# Altium schematic sheet Main.SchDoc
size A3
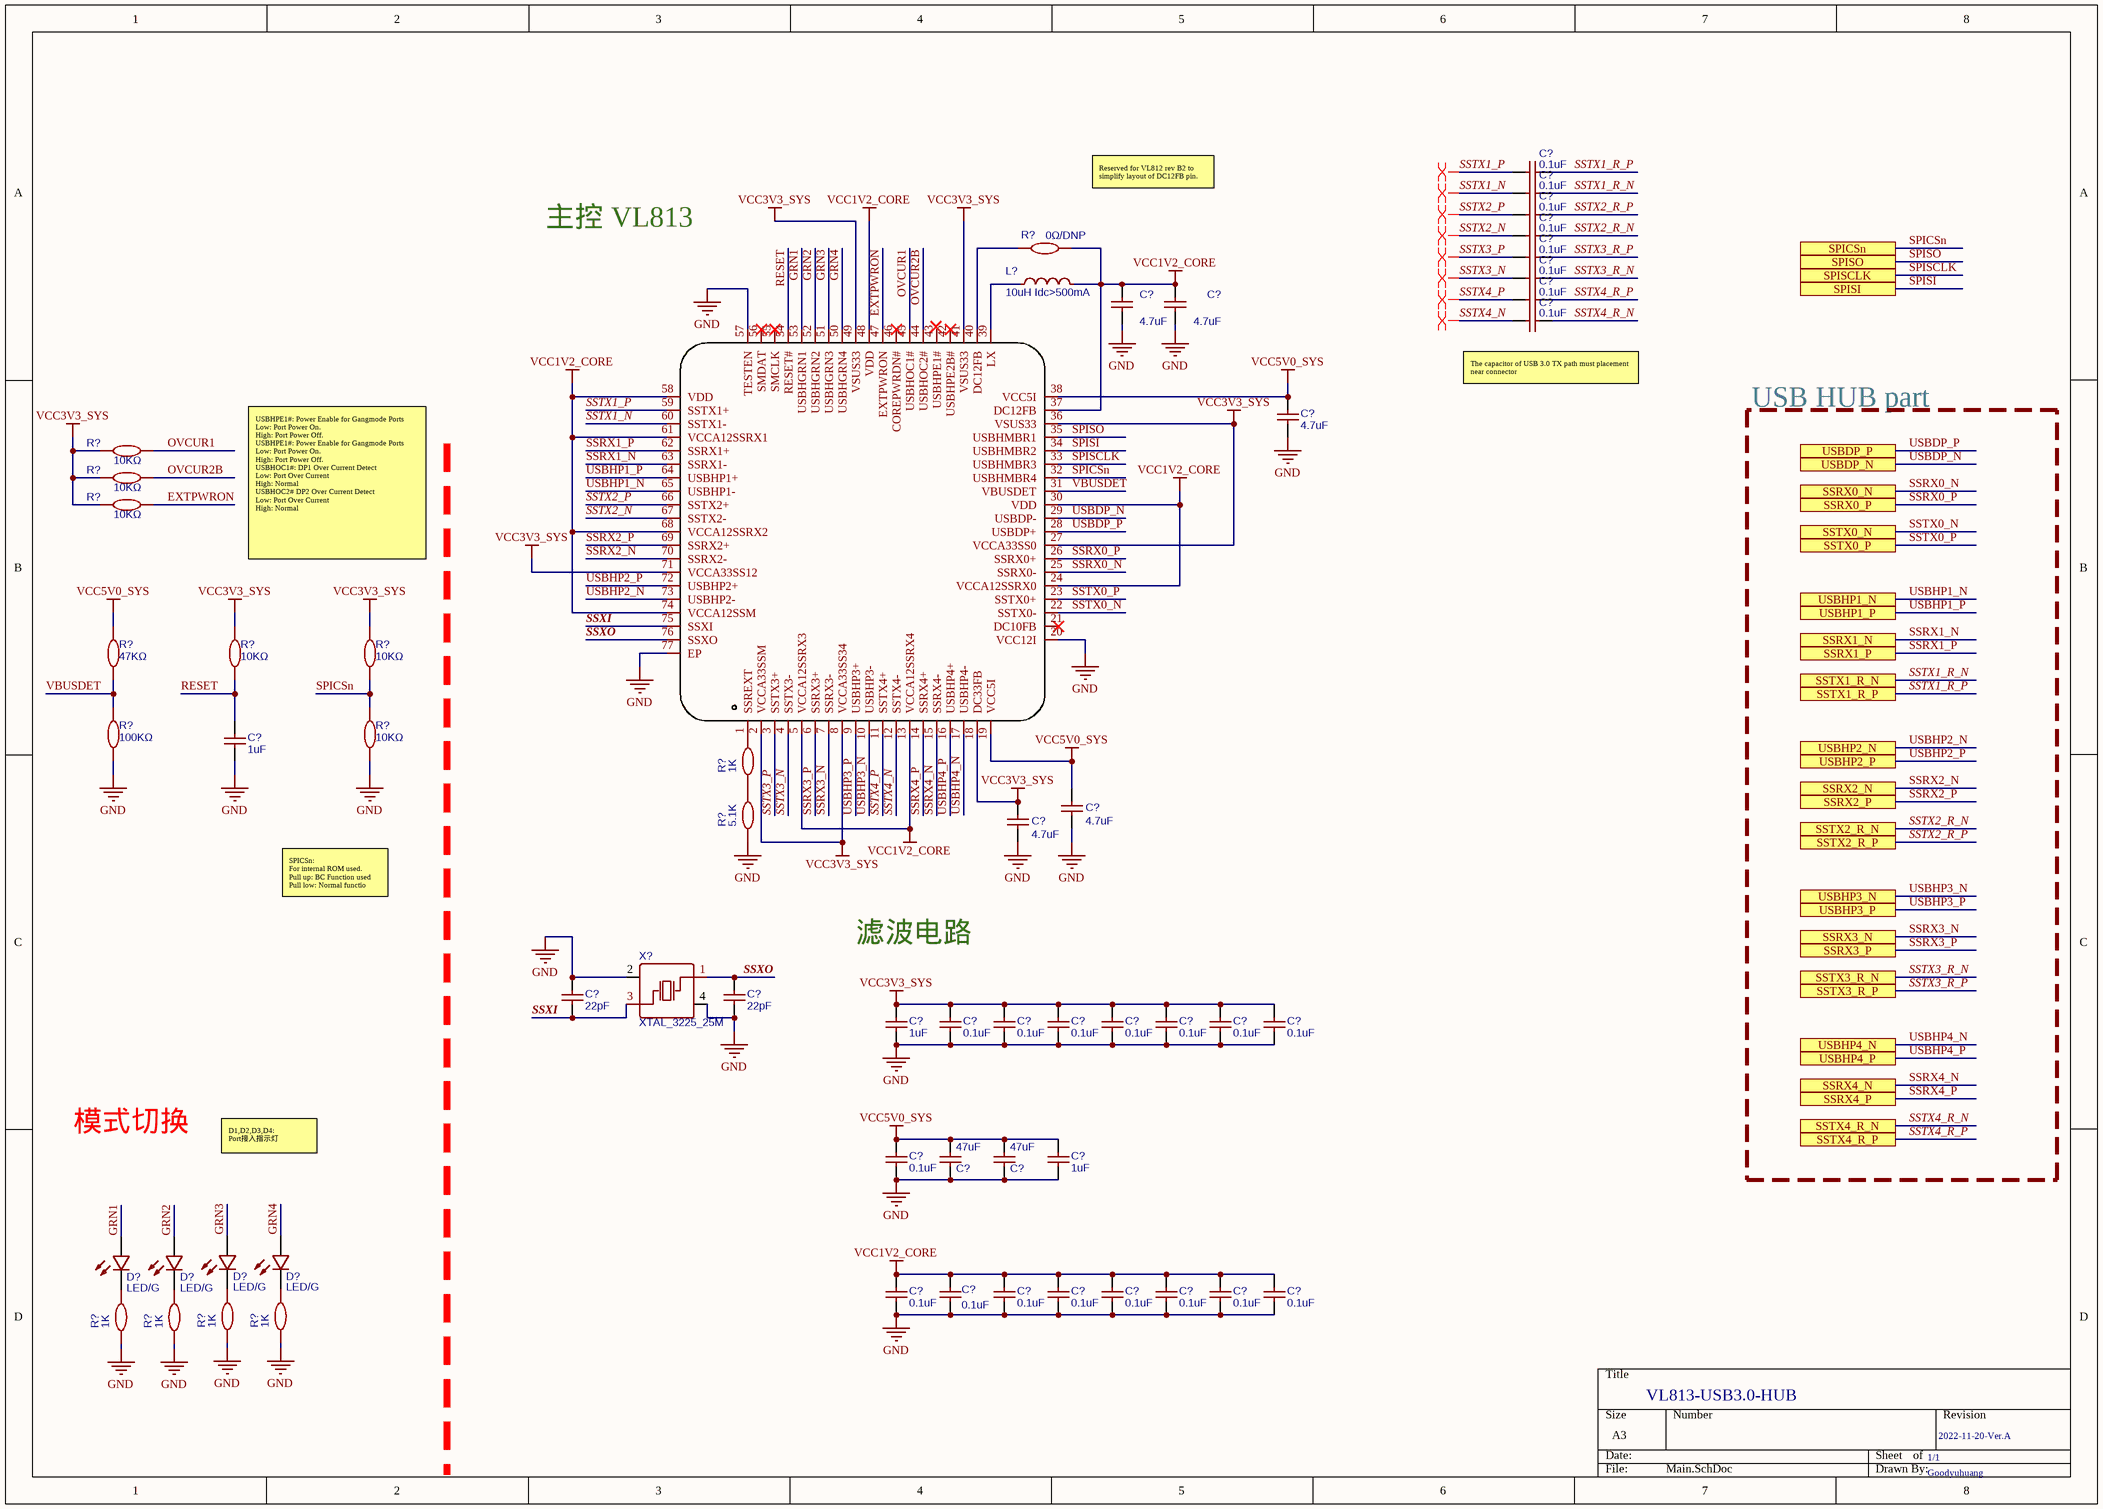
[diagram p0: Main.SchDoc]

## Parts
(Parts that share a designator on the sheet are numbered #1, #2 ... from top to bottom, then left to right.)
C?#1  0.1uF  [C0603]
C?#2  0.1uF  [C0603]
C?#3  0.1uF  [C0603]
C?#4  0.1uF  [C0603]
C?#5  0.1uF  [C0603]
C?#6  0.1uF  [C0603]
C?#7  4.7uF  [C0603]
C?#8  4.7uF  [C0603]
C?#9  0.1uF  [C0603]
C?#10  0.1uF  [C0603]
C?#11  4.7uF  [C0603]
C?#12  1uF  [C0603]
C?#13  4.7uF  [C0603]
C?#14  4.7uF  [C0603]
C?#15  22pF  [C0603]
C?#16  22pF  [C0603]
C?#17  1uF  [C0603]
C?#18  0.1uF  [C0603]
C?#19  0.1uF  [C0603]
C?#20  0.1uF  [C0603]
C?#21  0.1uF  [C0603]
C?#22  0.1uF  [C0603]
C?#23  0.1uF  [C0603]
C?#24  0.1uF  [C0603]
C?#25  0.1uF  [C0603]
C?#26  47uF  [C5*5]
C?#27  47uF  [C5*5]
C?#28  1uF  [C0603]
C?#29  0.1uF  [C0603]
C?#30  0.1uF  [C0603]
C?#31  0.1uF  [C0603]
C?#32  0.1uF  [C0603]
C?#33  0.1uF  [C0603]
C?#34  0.1uF  [C0603]
C?#35  0.1uF  [C0603]
C?#36  0.1uF  [C0603]
D?#1  LED/G  [LED0805-R-RD]
D?#2  LED/G  [LED0805-R-RD]
D?#3  LED/G  [LED0805-R-RD]
D?#4  LED/G  [LED0805-R-RD]
L?  10uH Idc>500mA  [Inductor]
R?#1  0Ω/DNP  [R0603]
R?#2  10KΩ  [R0603]
R?#3  10KΩ  [R0603]
R?#4  10KΩ  [R0603]
R?#5  47KΩ  [R0603]
R?#6  10KΩ  [R0603]
R?#7  10KΩ  [R0603]
R?#8  100KΩ  [R0603]
R?#9  10KΩ  [R0603]
R?#10  1K  [R0603]
R?#11  5.1K  [R0603]
R?#12  1K  [R0603]
R?#13  1K  [R0603]
R?#14  1K  [R0603]
R?#15  1K  [R0603]
U?  VL813(A1)  [QFN-76]  (value not drawn)
X?  XTAL_3225_25M  [OSC-SMD_4P-L3.2-W2.5-BL_SIT8008BI]

## Ports
SPICSn, SPISCLK, SPISI, SPISO, SSRX0_N, SSRX0_P, SSRX1_N, SSRX1_P, SSRX2_N, SSRX2_P, SSRX3_N, SSRX3_P, SSRX4_N, SSRX4_P, SSTX0_N, SSTX0_P, SSTX1_R_N, SSTX1_R_P, SSTX2_R_N, SSTX2_R_P, SSTX3_R_N, SSTX3_R_P, SSTX4_R_N, SSTX4_R_P, USBDP_N, USBDP_P, USBHP1_N, USBHP1_P, USBHP2_N, USBHP2_P, USBHP3_N, USBHP3_P, USBHP4_N, USBHP4_P

## Nets
GND: C?#7.2 C?#8.2 C?#11.2 C?#12.2 C?#13.2 C?#14.2 C?#15.2 C?#16.2 C?#17.2 C?#18.2 C?#19.2 C?#20.2 C?#21.2 C?#22.2 C?#23.2 C?#24.2 C?#25.2 C?#26.2 C?#27.2 C?#28.2 C?#29.2 C?#30.2 C?#31.2 C?#32.2 C?#33.2 C?#34.2 C?#35.2 C?#36.2 R?#8.2 R?#9.2 R?#11.2 R?#12.2 R?#13.2 R?#14.2 R?#15.2 U?.20(VCC12I) U?.57(TESTEN) U?.77(EP) X?.2(GND) X?.4(GND)
VCC1V2_CORE: C?#7.1 C?#8.1 C?#29.1 C?#30.1 C?#31.1 C?#32.1 C?#33.1 C?#34.1 C?#35.1 C?#36.1 L?.2 R?#1.1 U?.5(VCCA12SSRX3) U?.13(VCCA12SSRX4) U?.24(VCCA12SSRX0) U?.30(VDD) U?.37(DC12FB) U?.48(VDD) U?.58(VDD) U?.61(VCCA12SSRX1) U?.68(VCCA12SSRX2) U?.74(VCCA12SSM)
VCC3V3_SYS: C?#14.1 C?#17.1 C?#18.1 C?#19.1 C?#20.1 C?#21.1 C?#22.1 C?#23.1 C?#24.1 R?#2.1 R?#3.1 R?#4.1 R?#6.1 R?#7.1 U?.2(VCCA33SSM) U?.8(VCCA33SS34) U?.18(DC33FB) U?.27(VCCA33SS0) U?.36(VSUS33) U?.41(VSUS33) U?.49(VSUS33) U?.71(VCCA33SS12)
VCC5V0_SYS: C?#11.1 C?#13.1 C?#25.1 C?#26.1 C?#27.1 C?#28.1 R?#5.1 U?.19(VCC5I) U?.38(VCC5I)
EXTPWRON: R?#4.2 U?.47(EXTPWRON)
GRN1: D?#1.1(A) U?.53(USBHGRN1)
GRN2: D?#2.1(A) U?.52(USBHGRN2)
GRN3: D?#3.1(A) U?.51(USBHGRN3)
GRN4: D?#4.1(A) U?.50(USBHGRN4)
OVCUR1: R?#2.2 U?.45(USBHOC1#)
OVCUR2B: R?#3.2 U?.44(USBHOC2#)
RESET: C?#12.1 R?#6.2 U?.54(RESET#)
SPICSn: R?#7.2 R?#9.1 U?.32(USBHMBR4) ; port SPICSn
SPISCLK: U?.33(USBHMBR3) ; port SPISCLK
SPISI: U?.34(USBHMBR2) ; port SPISI
SPISO: U?.35(USBHMBR1) ; port SPISO
SSRX0_N: U?.25(SSRX0-) ; port SSRX0_N
SSRX0_P: U?.26(SSRX0+) ; port SSRX0_P
SSRX1_N: U?.63(SSRX1-) ; port SSRX1_N
SSRX1_P: U?.62(SSRX1+) ; port SSRX1_P
SSRX2_N: U?.70(SSRX2-) ; port SSRX2_N
SSRX2_P: U?.69(SSRX2+) ; port SSRX2_P
SSRX3_N: U?.7(SSRX3-) ; port SSRX3_N
SSRX3_P: U?.6(SSRX3+) ; port SSRX3_P
SSRX4_N: U?.15(SSRX4-) ; port SSRX4_N
SSRX4_P: U?.14(SSRX4+) ; port SSRX4_P
SSTX0_N: U?.22(SSTX0-) ; port SSTX0_N
SSTX0_P: U?.23(SSTX0+) ; port SSTX0_P
SSTX1_N: C?#2.1 U?.60(SSTX1-)
SSTX1_P: C?#1.1 U?.59(SSTX1+)
SSTX1_R_N: C?#2.2 ; port SSTX1_R_N
SSTX1_R_P: C?#1.2 ; port SSTX1_R_P
SSTX2_N: C?#4.1 U?.67(SSTX2-)
SSTX2_P: C?#3.1 U?.66(SSTX2+)
SSTX2_R_N: C?#4.2 ; port SSTX2_R_N
SSTX2_R_P: C?#3.2 ; port SSTX2_R_P
SSTX3_N: C?#6.1 U?.4(SSTX3-)
SSTX3_P: C?#5.1 U?.3(SSTX3+)
SSTX3_R_N: C?#6.2 ; port SSTX3_R_N
SSTX3_R_P: C?#5.2 ; port SSTX3_R_P
SSTX4_N: C?#10.1 U?.12(SSTX4-)
SSTX4_P: C?#9.1 U?.11(SSTX4+)
SSTX4_R_N: C?#10.2 ; port SSTX4_R_N
SSTX4_R_P: C?#9.2 ; port SSTX4_R_P
SSXI: C?#15.1 U?.75(SSXI) X?.3(OSC2)
SSXO: C?#16.1 U?.76(SSXO) X?.1(OSC1)
USBDP_N: U?.29(USBDP-) ; port USBDP_N
USBDP_P: U?.28(USBDP+) ; port USBDP_P
USBHP1_N: U?.65(USBHP1-) ; port USBHP1_N
USBHP1_P: U?.64(USBHP1+) ; port USBHP1_P
USBHP2_N: U?.73(USBHP2-) ; port USBHP2_N
USBHP2_P: U?.72(USBHP2+) ; port USBHP2_P
USBHP3_N: U?.10(USBHP3-) ; port USBHP3_N
USBHP3_P: U?.9(USBHP3+) ; port USBHP3_P
USBHP4_N: U?.17(USBHP4-) ; port USBHP4_N
USBHP4_P: U?.16(USBHP4+) ; port USBHP4_P
VBUSDET: R?#5.2 R?#8.1 U?.31(VBUSDET)
NetD?#1_2: D?#1.2(C) R?#12.1
NetD?#2_2: D?#2.2(C) R?#13.1
NetD?#3_2: D?#3.2(C) R?#14.1
NetD?#4_2: D?#4.2(C) R?#15.1
NetL?_1: L?.1 U?.39(LX)
NetR?#1_2: R?#1.2 U?.40(DC12FB)
NetR?#10_1: R?#10.1 U?.1(SSREXT)
NetR?#10_2: R?#10.2 R?#11.1

Not connected (* = marked no-connect by the designer): U? 21(DC10FB)* 42(USBHPE2B#)* 43(USBHPE1#) 46(COREPWRDN#)* 55(SMCLK)* 56(SMDAT)*

## Layout directives
differential pair: SSTX1_N, SSTX1_P, SSTX2_N, SSTX2_P, SSTX3_N, SSTX3_P, SSTX4_N, SSTX4_P

## Notes on the sheet
- Reserved for VL812 rev B2 to simplify layout of DC12FB pin.
- 主控 VL813
- (near C?#10) The capacitor of USB 3.0 TX path must placement near connector
- USB HUB part
- USBHPE1#:	Power Enable for Gangmode Ports
  Low: Port Power On.
  High: Port Power Off.
  USBHPE1#:	Power Enable for Gangmode Ports
  Low: Port Power On.
  High: Port Power Off.
  USBHOC1#:	DP1 Over Current Detect
  Low: Port Over Current
  High: Normal
  USBHOC2#	DP2 Over Current Detect
  Low: Port Over Current
  High: Normal
- SPICSn:
  For internal ROM used.
  Pull up: BC Function used
  Pull low: Normal functio
- 滤波电路
- 模式切换
- D1,D2,D3,D4:
  Port接入指示灯
- VL813-USB3.0-HUB
- 1/1
- 2022-11-20-Ver.A
- Goodyuhuang

## Library data of the parts
C?#1-C?#36 = C: BOM_Manufacturer: FH; BOM_Manufacturer Part: 0603F104M500NT; nameAlias: Capacitance; BOM_Supplier: LCSC; BOM_Supplier Part: C42998; BOM_JLCPCB Part Class: Extended Part; spicePre: C; spiceSymbolName: 0603F104M500NT
D?#1-D?#4 = 17-21SURC/S530-A3/TR8: BOM_Manufacturer: EVERLIGHT; BOM_Supplier: LCSC; BOM_Manufacturer Part: 17-21SURC/S530-A3/TR8; BOM_Supplier Part: C72037; BOM_JLCPCB Part Class: Extended Part; spicePre: L; spiceSymbolName: 17-21SURC/S530-A3/TR8
L? = L: BOM_Manufacturer Part: VHF160808H33NJT; BOM_Manufacturer: FH; nameAlias: Inductance; BOM_Supplier: LCSC; BOM_Supplier Part: C90209; BOM_JLCPCB Part Class: Extended Part; spicePre: L; spiceSymbolName: VHF160808H33NJT
R?#1-R?#15 = R: BOM_Manufacturer: Guangdong Fenghua Advanced Tech; BOM_Manufacturer Part: RS-03K1002FT; Resistance (Ohms): 10K; nameAlias: Resistance; Contributor: LCSC; BOM_Supplier: LCSC; BOM_Supplier Part: C115324; spicePre: R; spiceSymbolName: RS-03K1002FT
U? = VL813(A1): Manufacturer: VIA(台湾威盛电子); Symbol: VL813(A1)_C209755; Add into BOM: yes; Name: VL813(A1); Device: VL813(A1); LCSC Part Name: VL813(A1); Supplier Part: C209755; Manufacturer Part: VL813(A1); Supplier Footprint: QFN-76_9x9x04P; JLCPCB Part Class: Extended Part; Datasheet: https://atta.szlcsc.com/upload/public/pdf/source/20180420/C209755_1BF0F45DD04BFA941B7FD492504FA511.pdf; Supplier: LCSC; Convert to PCB: yes; Type: -; Protocol: -; Number of Drivers/Receivers: -; Data Rate: -; Supply Voltage: -
X? = XTAL_3225_40M: BOM_Manufacturer: YXC; BOM_Manufacturer Part: X322540MPB4SI; nameAlias: Frequency; BOM_Supplier: LCSC; BOM_Supplier Part: C9010; BOM_JLCPCB Part Class: Extended Part; spicePre: X; spiceSymbolName: X322540MPB4SI